# Altium schematic sheet RFID2.SchDoc
size A
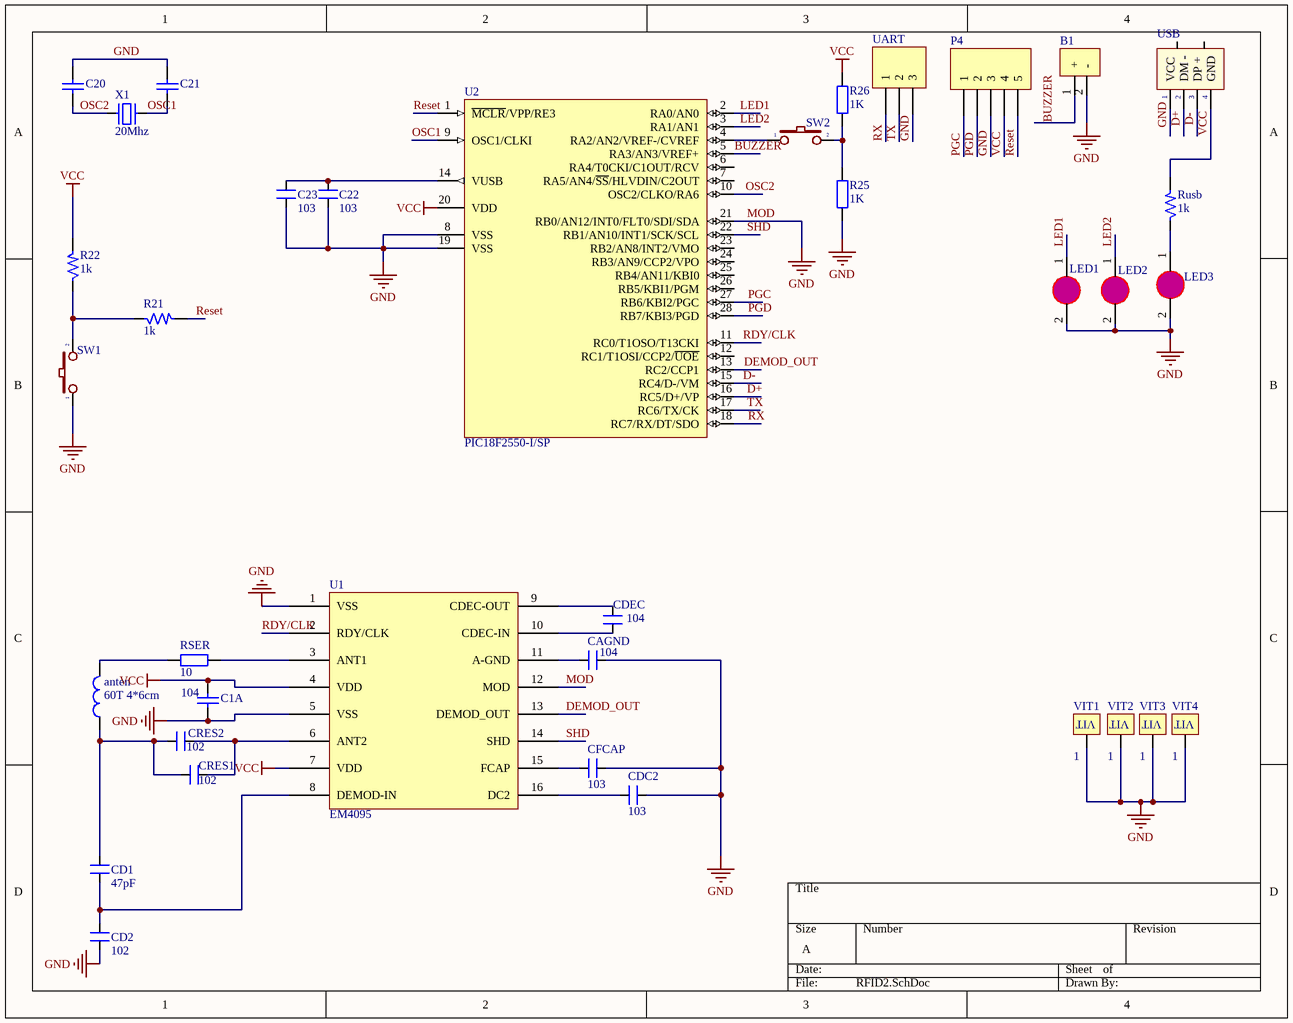
[diagram p0: RFID2.SchDoc]

## Parts
anten  60T 4*6cm  [L/0.4]
B1  Buzzer  [Buzzer_9x12mm]  (value not drawn)
C1A  104  [SM-0805]
C20  27pf  [SM-0805]  (value not drawn)
C21  27pf  [SM-0805]  (value not drawn)
C22  103  [SM-0805]
C23  103  [SM-0805]
CAGND  104  [SM-0805]
CD1  47pF  [SM-0805]
CD2  102  [SM-0805]
CDC2  103  [SM-0805]
CDEC  104  [SM-0805]
CFCAP  103  [SM-0805]
CRES1  102  [SM-0805]
CRES2  102  [SM-0805]
LED1  LED3  [SM-0805]  (value not drawn)
LED2  (no value)  [SM-0805]
LED3  (no value)  [SM-0805]
P4  (no value)  [CON5]
R21  1k  [SM-0805]
R22  1k  [SM-0805]
R25  1K  [SM-0805]
R26  1K  [SM-0805]
RSER  10  [SM-0805]
Rusb  1k  [SM-0805]
SW1  SW  [SW2]  (value not drawn)
SW2  SW  [SW2]  (value not drawn)
U1  EM4095  [SO-16]
U2  PIC18F2550-I/SP  [SPDIP300-SP28]
UART  Header 3  [HDR1X3]  (value not drawn)
USB  USB-S  [USB_B]  (value not drawn)
VIT1  1  [VIT2]
VIT2  1  [VIT2]
VIT3  1  [VIT2]
VIT4  1  [VIT2]
X1  20Mhz  [XT2]

## Nets
GND: B1.2(-) C1A.1 C20.2 C21.2 C22.1 C23.1 CAGND.2 CD2.1 CDC2.1 CFCAP.2 LED1.2(K) LED2.2(K) LED3.2(K) P4.3 R25.1 SW1.1 U1.1(VSS) U1.5(VSS) U1.12(MOD) U2.8(VSS) U2.19(VSS) U2.21(RB0/AN12/INT0/FLT0/SDI/SDA) UART.3 USB.1(VCC) VIT1.VIT1 VIT2.VIT1 VIT3.VIT1 VIT4.VIT1  [also labelled MOD]
VCC: C1A.2 P4.4 R22.2 R26.2 Rusb.2 U1.4(VDD) U1.7(VDD) U2.20(VDD) USB.4(GND)
BUZZER: B1.1(+) U2.5(RA3/AN3/VREF+)
D+: U2.16(RC5/D+/VP) USB.2(DM_-)
D-: U2.15(RC4/D-/VM) USB.3(DP_+)
DEMOD_OUT: U1.13(DEMOD_OUT) U2.13(RC2/CCP1)
LED1: LED1.1(A) U2.2(RA0/AN0)
LED2: LED2.1(A) U2.3(RA1/AN1)
OSC1: C21.1 U2.9(OSC1/CLKI) X1.2
OSC2: C20.1 U2.10(OSC2/CLKO/RA6) X1.1
PGC: P4.1 U2.27(RB6/KBI2/PGC)
PGD: P4.2 U2.28(RB7/KBI3/PGD)
RDY/CLK: U1.2(RDY/CLK) U2.11(RC0/T1OSO/T13CKI)
Reset: P4.5 R21.2 U2.1(~{MCLR}/VPP/RE3)
RX: U2.18(RC7/RX/DT/SDO) UART.1
SHD: U1.14(SHD) U2.22(RB1/AN10/INT1/SCK/SCL)
TX: U2.17(RC6/TX/CK) UART.2
Netanten_1: anten.1 CD1.2 CRES1.1 CRES2.1
Netanten_2: anten.2 RSER.1
NetC22_2: C22.2 C23.2 U2.14(VUSB)
NetCAGND_1: CAGND.1 U1.11(A-GND)
NetCD1_1: CD1.1 CD2.2 U1.8(DEMOD-IN)
NetCDC2_2: CDC2.2 U1.16(DC2)
NetCDEC_1: CDEC.1 U1.10(CDEC-IN)
NetCDEC_2: CDEC.2 U1.9(CDEC-OUT)
NetCFCAP_1: CFCAP.1 U1.15(FCAP)
NetCRES1_2: CRES1.2 CRES2.2 U1.6(ANT2)
NetLED3_1: LED3.1(A) Rusb.1
NetR21_1: R21.1 R22.1 SW1.2
NetR25_2: R25.2 R26.1 SW2.2
NetRSER_2: RSER.2 U1.3(ANT1)
NetSW2_1: SW2.1 U2.4(RA2/AN2/VREF-/CVREF)

Not connected (* = marked no-connect by the designer): U2 6(RA4/T0CKI/C1OUT/RCV) 7(RA5/AN4/~{SS}/HLVDIN/C2OUT) 12(RC1/T1OSI/CCP2/~{UOE}) 23(RB2/AN8/INT2/VMO) 24(RB3/AN9/CCP2/VPO) 25(RB4/AN11/KBI0) 26(RB5/KBI1/PGM); USB 5 6

## Library data of the parts
anten = L1: Inductor; Value: 150 mH
C1A = Cap: Capacitor; Published: 8-Jun-2000; LatestRevisionDate: 17-Jul-2002; LatestRevisionNote: Re-released for DXP Platform.; PackageReference: RAD-0.3; Publisher: Altium Limited; Value: 104
C20 C21 = CapSMD: Capacitor; Value: 33p; Published: 8-Jun-2000; LatestRevisionDate: 17-Jul-2002; LatestRevisionNote: Re-released for DXP Platform.; PackageReference: RAD-0.3; Publisher: Altium Limited
C22 C23 CDC2 CFCAP = CM: Cap SMD; Value: 103
CAGND CD1 CD2 CDEC CRES1 CRES2 = CM: Cap SMD; Value: 103
LED1-LED3 = LEDSMD: LED 3mm
P4 = Header 5: Header, 5-Pin; LatestRevisionDate: 17-Jul-2002; LatestRevisionNote: Re-released for DXP Platform.; Publisher: Altium Limited
R21 R22 Rusb = R: Resistor 1/4W; Value: R1/4W - 1K
R25 R26 = RM: Resistor SMD; Value: 1K
RSER = RM: Resistor SMD; Value: 1K
SW1 SW2 = SW2: Switch button 2 pin; Value: SW chip 2 pin
U2 = PIC18F2550-I/SP: High Performance, Enhanced Flash, USB Microcontroller with nanoWatt Technology, 32K Flash, 28-Pin SPDIP, Industrial Temperature Range; FirstPublished: 29-Jan-2009; LatestRevisionDate: 02-Dec-2009; LatestRevisionNote: Updated to datasheet revision E, Aug-2008; DatasheetVersion: revE, Aug-2008; PackageVersion: revBB, Aug-2009; PackageReference: SPDIP300-SP28; Publisher: Altium Limited; PackageDescription: 28-Lead Skinny Plastic Dual In-Line (SP) - 300 mil Body [SPDIP]; Supplier 1: Digi-Key; Supplier Part Number 1: PIC18F2550-I/SP-ND; Supplier 2: Farnell; Supplier Part Number 2: 1523822; Supplier 3: Farnell; Supplier Part Number 3: 9321250; Supplier 4: Newark; Supplier Part Number 4: 80K6054; ComponentLink1Description: Datasheet; ComponentLink1URL: http://ww1.microchip.com/downloads/en/DeviceDoc/39632e.pdf; ComponentLink2Description: Packaging Specification; ComponentLink2URL: http://www.microchip.com/stellent/groups/techpub_sg/documents/packagingspec/en012702.pdf; ComponentLink3Description: Microchip.com Home; ComponentLink3URL: http://www.microchip.com/
UART = Header 3: Header, 3-Pin; LatestRevisionDate: 17-Jul-2002; LatestRevisionNote: Re-released for DXP Platform.; Publisher: Altium Limited
USB = USB_S: USB connector; Value: USB
VIT1-VIT4 = VIT: Oc Vit
X1 = XT2: Crystal For all Crystal 2pin.; Value: 4Mhz